# Altium project ethernet-con.PrjPCB
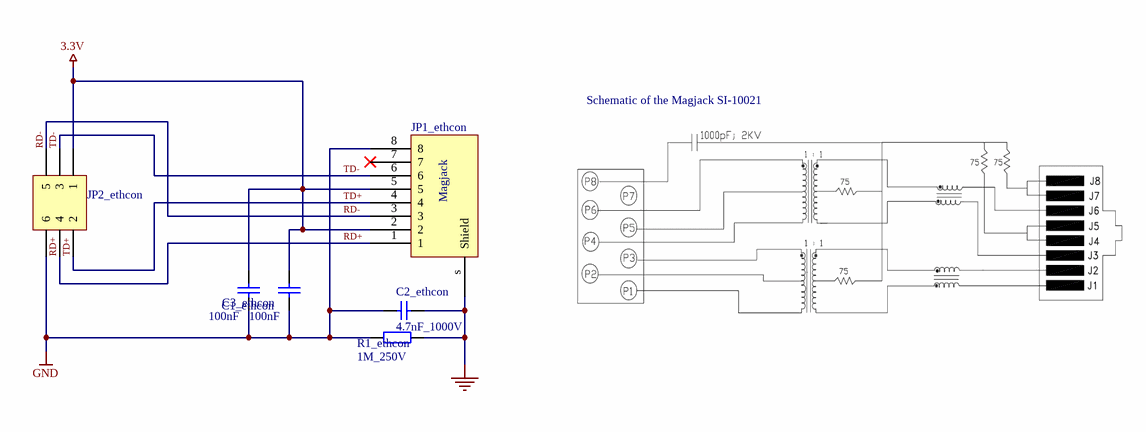
[diagram p0: ethernet-connector.SchDoc]
1 sheet, 7 parts. Net scope: global (net labels, ports and power ports of the same name join across sheets).
Board file: ethernet-con.PcbDoc

## Sheet ethernet-connector.SchDoc: Ethernet Connector PCB
size A4; Organization: Berne University of Applied Science; Address1: School of Engineering and; Address2: Information Technology; Address3: Quellgasse 21; Address4: CH-2501 Biel; Revision: 1.0; SheetNumber: 18; SheetTotal: 19; Author: zac1; PageSetup: Record=PageOptions|CenterHorizontal=True|CenterVertical=True|PrintScale=1.00|XCorrection=1.00|YCorrection=1.00|PrintKind=0|BorderSize=5000000|LeftOffset=0|BottomOffset=0|Orientation=2|PaperLength=1000|PaperWidth=1000|Scale=100|PaperSource=7|PrintQuality=-4|MediaType=1|DitherType=10|PaperKind=A4|PrintScaleMode=1

### Parts
1_ethcon  CC License  [CC-License]  (value not drawn)
C1_ethcon  value 100nF  [0402]  (hidden comment: Cap)
C2_ethcon  value 4.7nF_1000V  [c-r5]  (hidden comment: C)
C3_ethcon  value 100nF  [0402]  (hidden comment: Cap)
JP1_ethcon  SI-10021  [SI-10021]
JP2_ethcon  M22-2540305  [M22-2540305]  (value not drawn)
R1_ethcon  value 1M_250V  [CC3216-1206]  (hidden comment: Res2)

### Nets
3.3V: C1_ethcon.2 C3_ethcon.2 JP1_ethcon.2 JP1_ethcon.5 JP2_ethcon.1
Earth: C2_ethcon.1 JP1_ethcon.s(Shield) R1_ethcon.1
GND: C1_ethcon.1 C2_ethcon.2 C3_ethcon.1 JP1_ethcon.8 JP2_ethcon.6 R1_ethcon.2
RD+: JP1_ethcon.1 JP2_ethcon.4
RD-: JP1_ethcon.3 JP2_ethcon.5
TD+: JP1_ethcon.4 JP2_ethcon.2
TD-: JP1_ethcon.6 JP2_ethcon.3

Not connected (* = marked no-connect by the designer): JP1_ethcon 7*

### Notes on the sheet
- Schematic of the Magjack SI-10021
- Title:
- Size:
- Date:
- A4_L
- Author:
- Time:
- Revision:
- Sheet
- of
- File:
- (in symbol SI-10021) Magjack

### Library data of the parts
C1_ethcon C3_ethcon = Cap: Capacitor; Manufacturer: Murata; Part Number: GRM155R71C104KA88D; Class I: Passive; Currency: CHF; Packaging unit: 10; Revision: July-2002: Re-released for DXP Platform.; Class II: Capacitor; Publisher: Altium Limited; Published: 8-Jun-2000; Distributor: Farnell; Distributor Number: 8819 742; RoHS: yes; Price: 0.07
C2_ethcon = C: Manufacturer: Murata; Part Number: DEBF33A472ZC1B; Currency: CHF; Packaging unit: 1; Distributor: Farnell; Distributor Number: 9527 249; RoHS: yes; Price: 0.52
JP1_ethcon = SI-10021: MagJack from Bel Stewart, single port RJ45 with magnetics, without LED's; Currency: CHF; Packaging unit: 1; Value: SI-10021; Distributor: Farnell; Distributor Number: 1137 981; Manufacturer: Stewart; Part Number: SI-10021; RoHS: yes; Price: 12.65
JP2_ethcon = M22-2540305: Manufacturer: HARWIN; Part Number: M22F2040305; Currency: CHF; Packaging unit: 1; Value: M22-2540305; Distributor: Farnell; Distributor Number: 672 210; RoHS: yes; Price: 2.3
R1_ethcon = Res2: Resistor; Manufacturer: Multicomp; Part Number: MC 0.125W 1206 1% 1M; Class I: Passive; Currency: CHF; Packaging unit: 50; Published: 8-Jun-2000; Revision: July-2002: Re-released for DXP Platform.; Publisher: Altium Limited; Class II: Resistor; Distributor: Farnell; Distributor Number: 9335 781; RoHS: X-yes; Price: 0.055